# Altium schematic sheet Thermometer.SchDoc
size A4
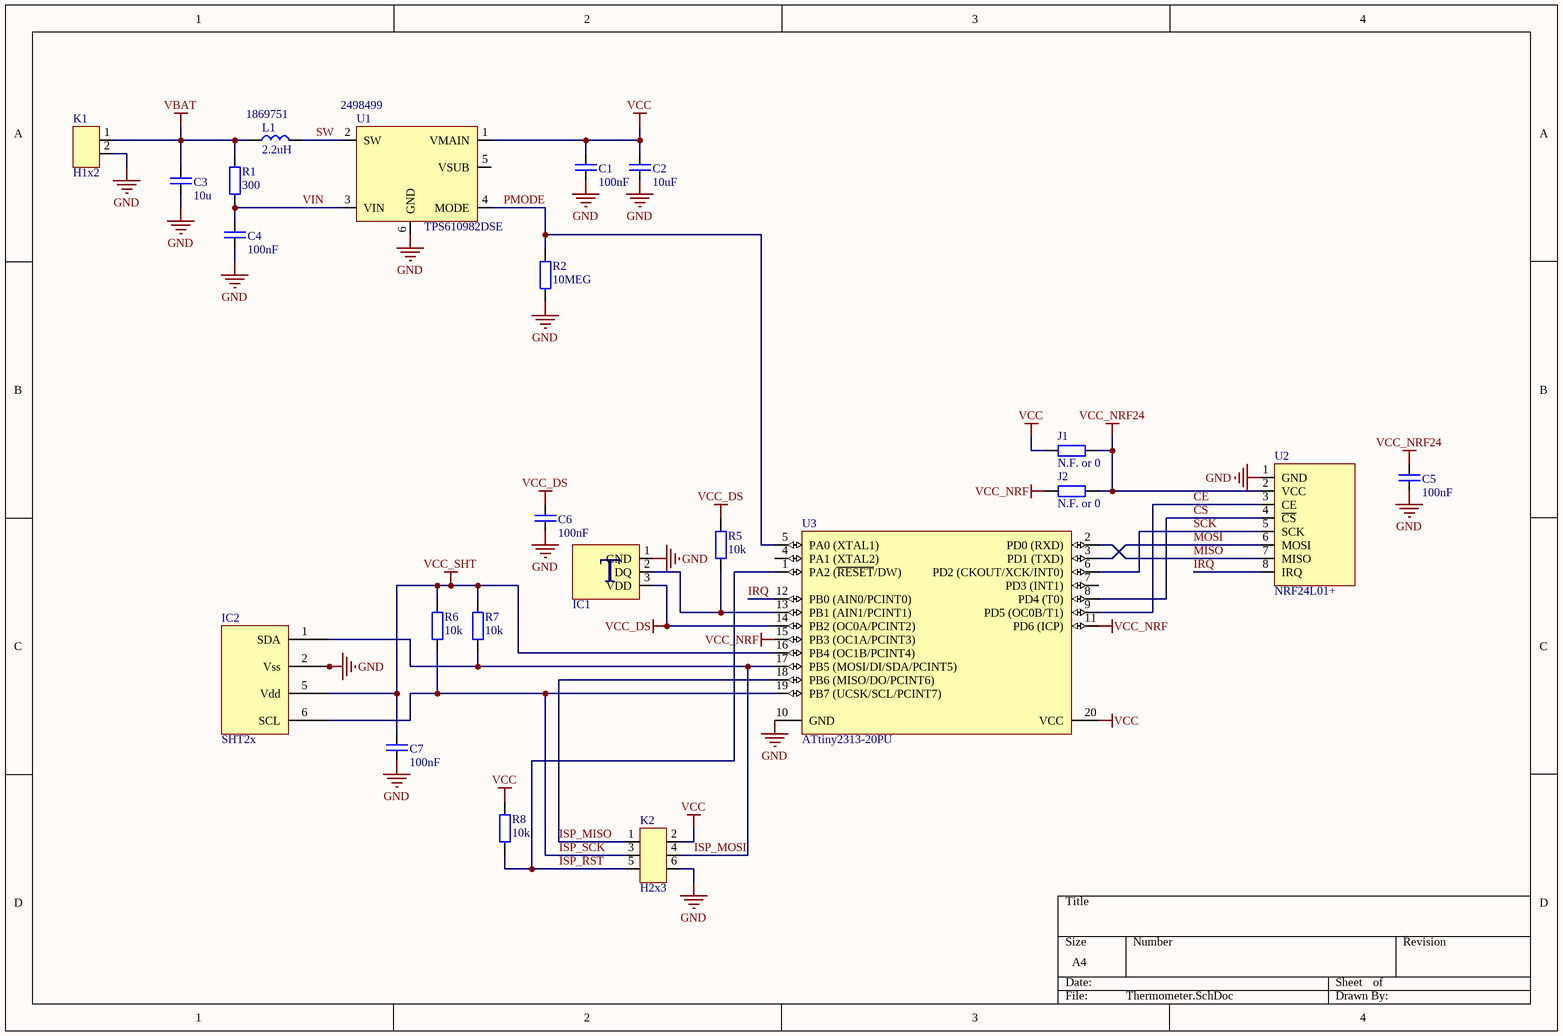
[diagram p0: Thermometer.SchDoc]

## Parts
C1  100nF  [C2012_0805I_M]
C2  10uF  [C3225_1210I_M]
C3  10u  [C3225_1210I_M]
C4  100nF  [C2012_0805I_M]
C5  100nF  [C2012_0805I_M]
C6  100nF  [C2012_0805I_M]
C7  100nF  [C2012_0805I_M]
IC1  DS18B20  [TO92]  (value not drawn)
IC2  SHT2x  [DFN6]
J1  N.F. or 0  [R2012_0805I_M]
J2  N.F. or 0  [R2012_0805I_M]
K1  H1x2  [H1x2]
K2  H2x3  [H2x3]
L1  2.2uH  Supplier Part Number 1: 1869751  [R2012_0805I_M]
R1  300  [R2012_0805I_M]
R2  10MEG  [R2012_0805I_M]
R5  10k  [R2012_0805I_M]
R6  10k  [R2012_0805I_M]
R7  10k  [R2012_0805I_M]
R8  10k  [R2012_0805I_M]
U1  TPS610982DSE  Supplier Part Number 1: 2498499  [WSON6M]
U2  NRF24L01+  [NRF24L01+tht_module]
U3  ATtiny2313-20PU  [20P3]

## Nets
GND: C1.2 C2.2 C3.2 C4.2 C5.2 C6.2 C7.2 IC1.1(GND) IC2.0(power_pad) IC2.2(Vss) K1.2 K2.6 R2.2 U1.6(GND) U2.1(GND) U3.10(GND)
VBAT: C3.1 K1.1 L1.1 R1.1
VCC: C1.1 C2.1 J1.1 K2.2 R8.1 U1.1(VMAIN) U3.20(VCC)
VCC_DS: C6.1 IC1.3(VDD) R5.1 U3.14(PB2_(OC0A/PCINT2))
VCC_NRF: J2.1 U3.11(PD6_(ICP)) U3.15(PB3_(OC1A/PCINT3))
VCC_NRF24: C5.1 J1.2 J2.2 U2.2(VCC)
VCC_SHT: C7.1 IC2.5(Vdd) R6.1 R7.1 U3.16(PB4_(OC1B/PCINT4))
CE: U2.3(CE) U3.9(PD5_(OC0B/T1))
CS: U2.4(~{CS}) U3.8(PD4_(T0))
IRQ: U2.8(IRQ) U3.12(PB0_(AIN0/PCINT0))
ISP_MISO: K2.1 U3.18(PB6_(MISO/DO/PCINT6))
ISP_MOSI: IC2.1(SDA) K2.4 R7.2 U3.17(PB5_(MOSI/DI/SDA/PCINT5))
ISP_RST: K2.5 R8.2 U3.1(PA2_(~{RESET}/DW))
ISP_SCK: IC2.6(SCL) K2.3 R6.2 U3.19(PB7_(UCSK/SCL/PCINT7))
MISO: U2.7(MISO) U3.2(PD0_(RXD))
MOSI: U2.6(MOSI) U3.3(PD1_(TXD))
PMODE: R2.1 U1.4(MODE) U3.5(PA0_(XTAL1))
SCK: U2.5(SCK) U3.6(PD2_(CKOUT/XCK/INT0))
SW: L1.2 U1.2(SW)
VIN: C4.1 R1.2 U1.3(VIN)
NetIC1_2: IC1.2(DQ) R5.2 U3.13(PB1_(AIN1/PCINT1))

Not connected (* = marked no-connect by the designer): U1 5(VSUB); U3 4(PA1_(XTAL2)) 7(PD3_(INT1))

## Notes on the sheet
- (in symbol DS18B20) T

## Library data of the parts
C1-C7 = C: Capacitor
IC1 = DS18B20: Temperature sensor 1-wire interface
IC2 = SHT2x: Voltage: 50V; Tolerance: 5%; max.Temperature: +125; min.Temperature: -40
J1 J2 R1 R2 R5-R8 = R
K1 = H1x2: Header 1x2 (male)
K2 = H2x3: Header 2x3 (male)
L1 = L: Supplier 1: Farnell
U2 = NRF24L01+: 2.4GHz low power, long range module
U3 = ATtiny2313-20PU: Low Power tinyAVR® 8-Bit Microcontroller, 2.7-5.5V, 20MHz, 2K Flash Memory, Industrial Grade (-40°C to 85°C), 20-Lead PDIP, Pb-Free; DatasheetVersion: revL, Aug-2010; PackageVersion: revD, Oct-2010; PackageReference: 20P3; PackageDescription: 20-lead (0.300"/7.62mm Wide) Plastic Dual Inline Package (PDIP); Code_JEDEC: MS-001-AD; ComponentLink1Description: Manufacturer URL; ComponentLink1URL: http://www.atmel.com/; ComponentLink2Description: ATtiny2313 Datasheet; ComponentLink2URL: http://www.atmel.com/dyn/resources/prod_documents/doc2543.pdf; ComponentLink3Description: ATtiny2313 Summary; ComponentLink3URL: http://www.atmel.com/dyn/resources/prod_documents/doc2543S.pdf
U1 = TPS610982DSE: Supplier 1: Farnell